# EAGLE design G8CntlA (109,5x19) (EAGLE 9.1.1)
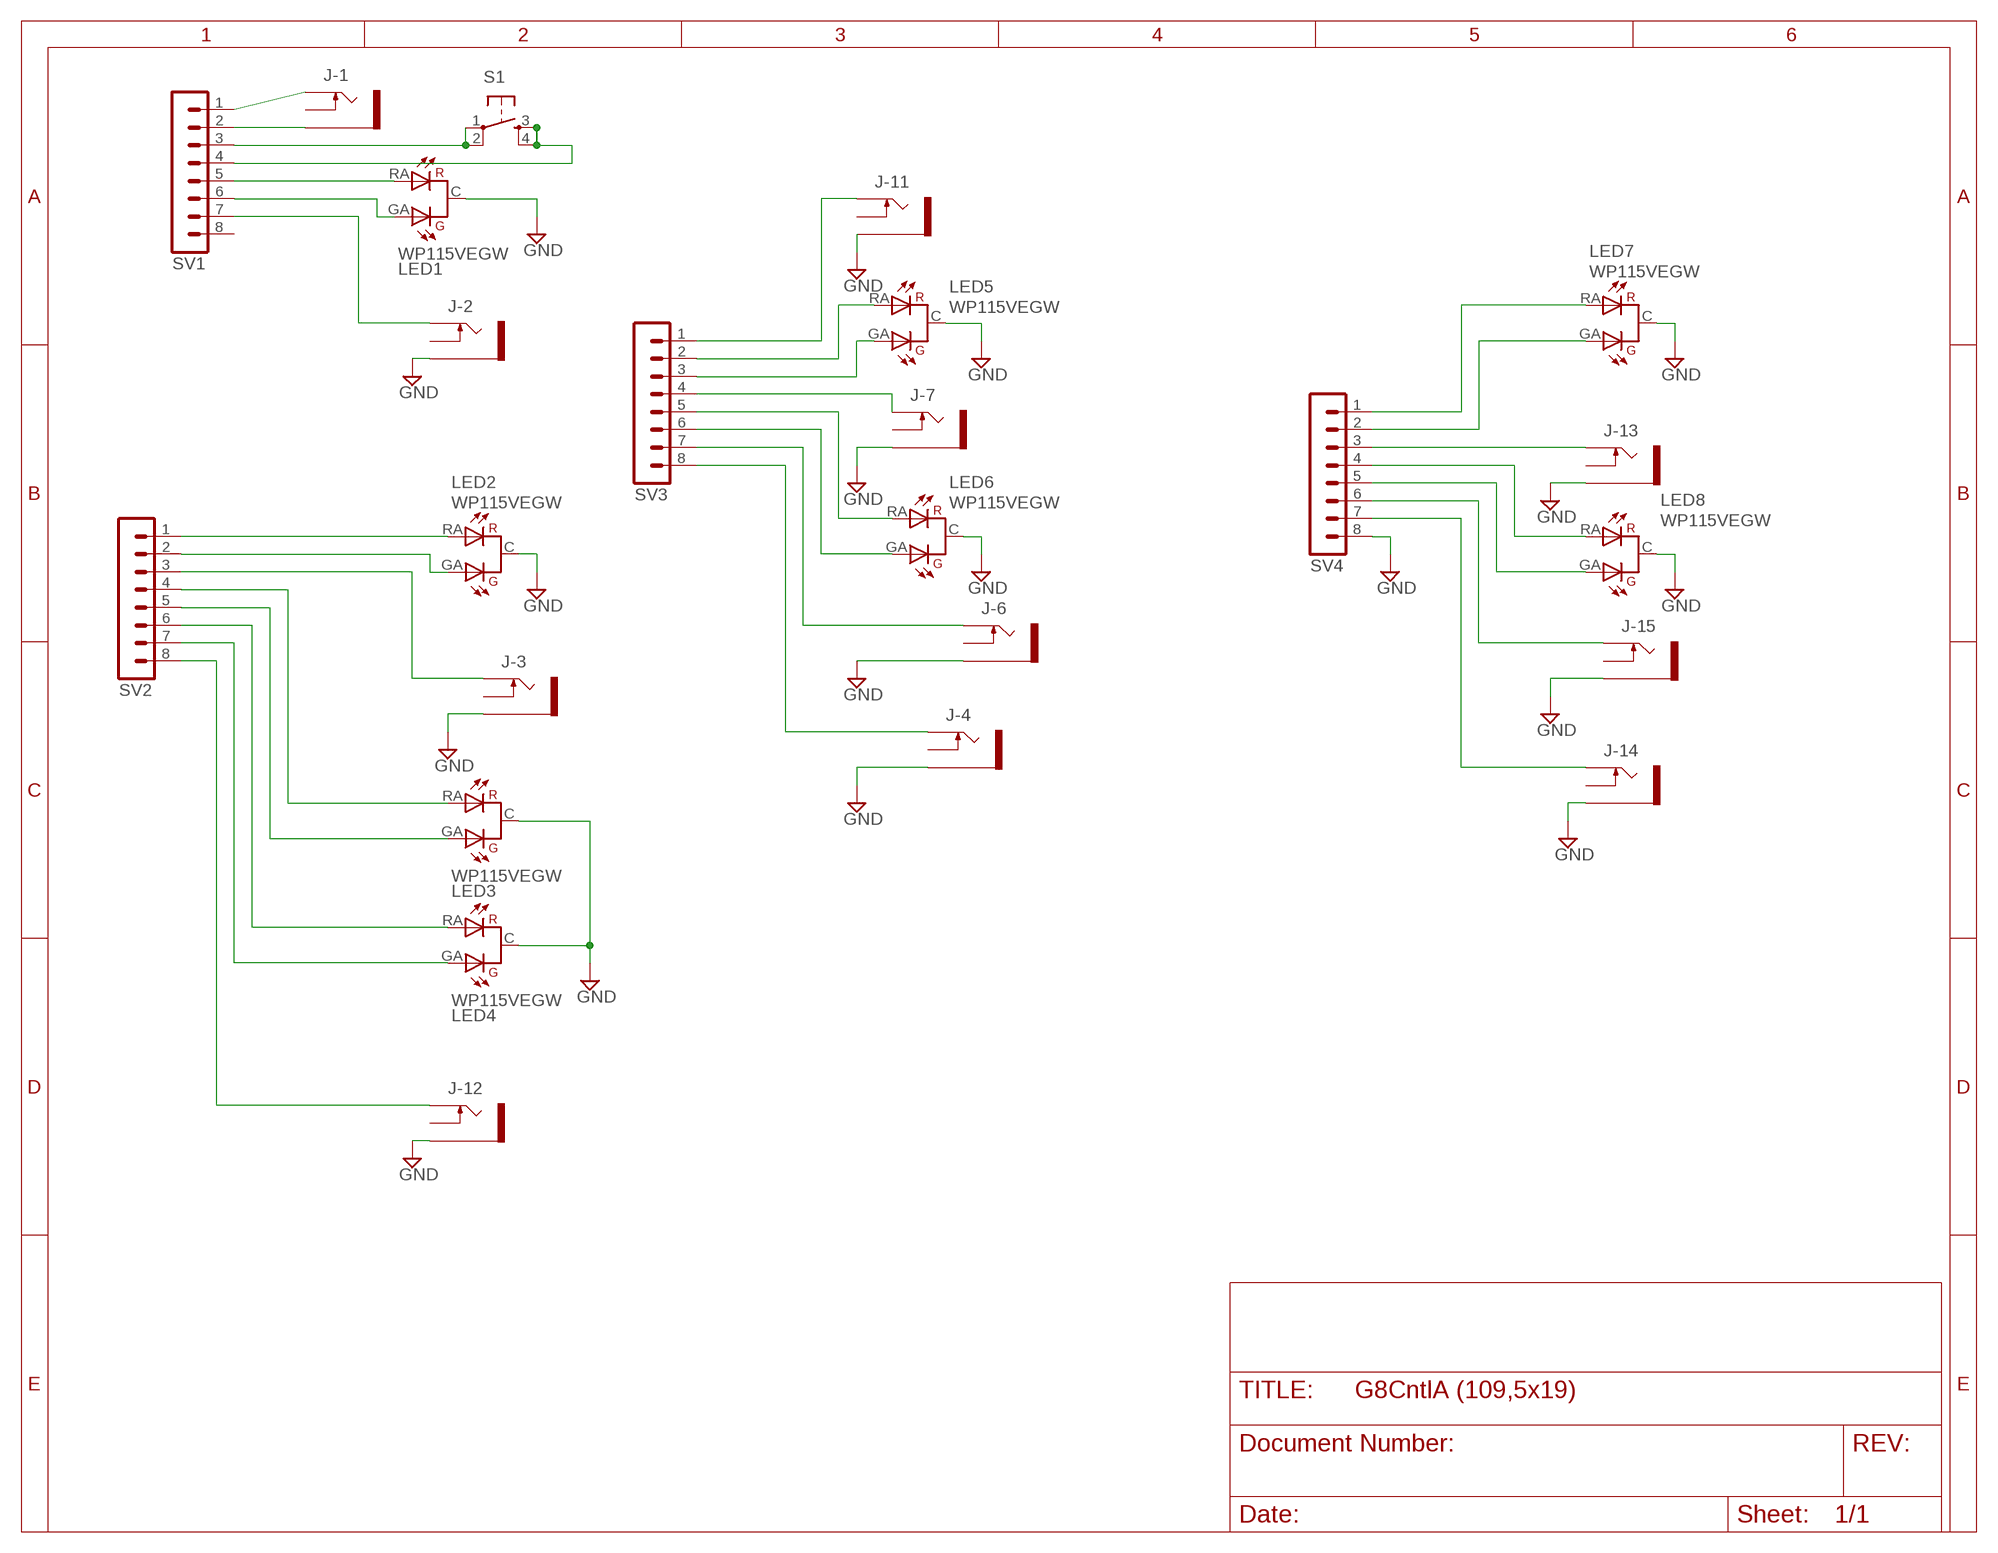
[diagram p0: schematic, sheet 1]

## Parts
J-1  THONKICONNNEW  [WQP-PJ301M-12_JACK]
J-2  THONKICONNNEW  [WQP-PJ301M-12_JACK]
J-3  THONKICONNNEW  [WQP-PJ301M-12_JACK]
J-4  THONKICONNNEW  [WQP-PJ301M-12_JACK]
J-6  THONKICONNNEW  [WQP-PJ301M-12_JACK]
J-7  THONKICONNNEW  [WQP-PJ301M-12_JACK]
J-11  THONKICONNNEW  [WQP-PJ301M-12_JACK]
J-12  THONKICONNNEW  [WQP-PJ301M-12_JACK]
J-13  THONKICONNNEW  [WQP-PJ301M-12_JACK]
J-14  THONKICONNNEW  [WQP-PJ301M-12_JACK]
J-15  THONKICONNNEW  [WQP-PJ301M-12_JACK]
LED1  WP115VEGW  [WP115VEGW]
LED2  WP115VEGW  [WP115VEGW]
LED3  WP115VEGW  [WP115VEGW]
LED4  WP115VEGW  [WP115VEGW]
LED5  WP115VEGW  [WP115VEGW]
LED6  WP115VEGW  [WP115VEGW]
LED7  WP115VEGW  [WP115VEGW]
LED8  WP115VEGW  [WP115VEGW]
S1  SPARKFUN_TAC_SWITCHPTH  [SPARKFUN_TACTILE-PTH]
SV1  MA08-1-O  [MA08-OCT]
SV2  MA08-1-O  [MA08-OCT]
SV3  MA08-1-O  [MA08-OCT]
SV4  MA08-1-O  [MA08-OCT]

## Nets
GND: J-2.P$3_SLEEVE(SLEEVE) J-3.P$3_SLEEVE(SLEEVE) J-4.P$3_SLEEVE(SLEEVE) J-6.P$3_SLEEVE(SLEEVE) J-7.P$3_SLEEVE(SLEEVE) J-11.P$3_SLEEVE(SLEEVE) J-12.P$3_SLEEVE(SLEEVE) J-13.P$3_SLEEVE(SLEEVE) J-14.P$3_SLEEVE(SLEEVE) J-15.P$3_SLEEVE(SLEEVE) LED1.C LED2.C LED3.C LED4.C LED5.C LED6.C LED7.C LED8.C SV4.8
N$1: S1.1 S1.2 SV1.3
N$2: S1.3 S1.4 SV1.4
N$3: LED2.RA(GA) SV2.1
N$4: J-1.P$1_TIP(TIP) SV1.1
N$5: J-1.P$3_SLEEVE(SLEEVE) SV1.2
N$6: J-2.P$1_TIP(TIP) SV1.7
N$7: LED1.RA(GA) SV1.5
N$8: LED1.GA(RA) SV1.6
N$9: LED2.GA(RA) SV2.2
N$10: J-3.P$1_TIP(TIP) SV2.3
N$11: LED3.RA(GA) SV2.4
N$12: LED3.GA(RA) SV2.5
N$13: J-12.P$1_TIP(TIP) SV2.8
N$14: LED4.RA(GA) SV2.6
N$15: LED4.GA(RA) SV2.7
N$16: J-11.P$1_TIP(TIP) SV3.1
N$17: LED5.RA(GA) SV3.2
N$18: LED5.GA(RA) SV3.3
N$19: J-7.P$1_TIP(TIP) SV3.4
N$20: LED6.RA(GA) SV3.5
N$21: LED6.GA(RA) SV3.6
N$22: J-6.P$1_TIP(TIP) SV3.7
N$23: J-4.P$1_TIP(TIP) SV3.8
N$24: J-15.P$1_TIP(TIP) SV4.6
N$25: J-13.P$1_TIP(TIP) SV4.3
N$26: J-14.P$1_TIP(TIP) SV4.7
N$27: LED7.RA(GA) SV4.1
N$28: LED7.GA(RA) SV4.2
N$29: LED8.RA(GA) SV4.4
N$30: LED8.GA(RA) SV4.5
Unconnected: J-1.P$2_SWITCH(SWITCH) J-2.P$2_SWITCH(SWITCH) J-3.P$2_SWITCH(SWITCH) J-4.P$2_SWITCH(SWITCH) J-6.P$2_SWITCH(SWITCH) J-7.P$2_SWITCH(SWITCH) J-11.P$2_SWITCH(SWITCH) J-12.P$2_SWITCH(SWITCH) J-13.P$2_SWITCH(SWITCH) J-14.P$2_SWITCH(SWITCH) J-15.P$2_SWITCH(SWITCH) SV1.8

## Library data of the parts
J-1-J-4 J-6 J-7 J-11-J-15 = !MusicThingModular:THONKICONN: 3.5mm socket for Eurorack modular synths
LED1-LED8 = tr-led:WP115VEGW
S1 = !tactile-pth:SPARKFUN_TAC_SWITCH: Momentary Switch Button commonly used for reset or general input. Spark Fun Electronics SKU : COM-00097
SV1-SV4 = tr-con:MA08-1: PIN HEADER

## Board
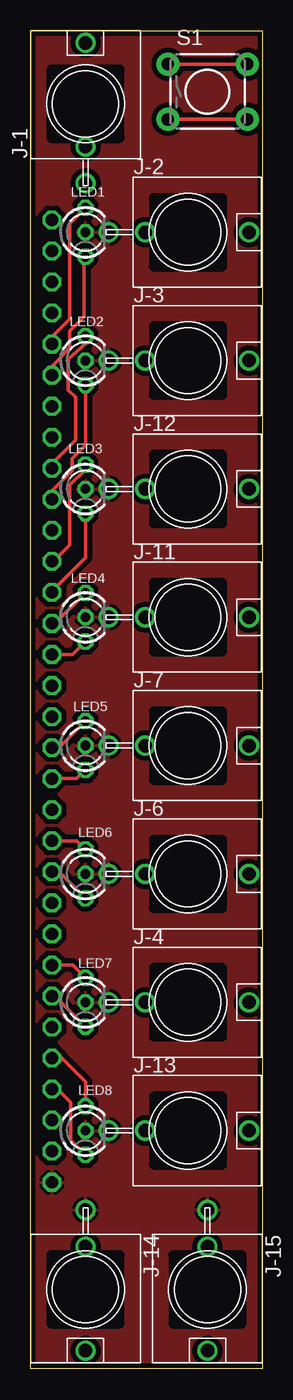
[diagram p1: board, top side]
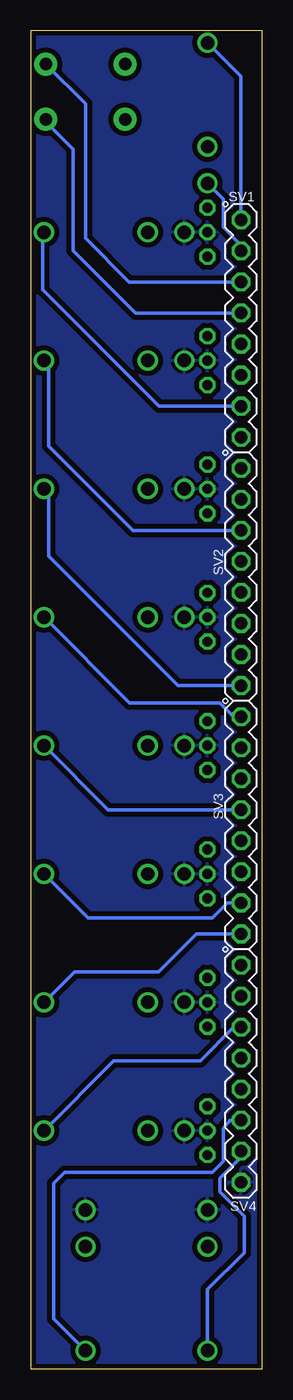
[diagram p2: board, bottom side, seen from below]

Size 19 x 109.5 mm. Coordinates in mm from the lower left corner, seen from the top.
Outline: 19,0 0,0 0,109.5 19,109.5 19,0
Copper layers (1*16): Top 0.035mm / dielectric 1.5mm / Bottom 0.035mm
Design rules "default *": minimum track width 8mil, minimum drill 24mil, track to track 8mil, track to pad 8mil, pad to pad 8mil, via to via 8mil, smd to smd 8mil, copper to edge 15mil, drill to drill 8mil, minimum pad ring 10mil, minimum via ring 8mil, stop-mask expansion 4mil, vias tented up to drill 0mil, thermal gap 10mil

### Footprints (pad centres in the part's own frame; a part is rotated, then mirrored left to right if it is on the bottom)
WQP-PJ301M-12_JACK = drill 1.1: P$1_TIP 0,5; P$2_SWITCH 0,-3.5; P$3_SLEEVE 0,-6.5
WP115VEGW = drill 0.8 octagon: C 0,0; GA 0,-2; RA 0,2
SPARKFUN_TACTILE-PTH = drill 1.016 pad 1.88: 1 -3.251,2.261; 2 3.251,2.261; 3 -3.251,-2.261; 4 3.251,-2.261
MA08-OCT = drill 1.016 octagon: 1 -8.89,0; 2 -6.35,0; 3 -3.81,0; 4 -1.27,0; 5 1.27,0; 6 3.81,0; 7 6.35,0; 8 8.89,0

### Placement (x,y rotation side)
J-1  4.5,103.5 0 top
J-2  12.9,93 270 top
J-3  12.9,82.5 270 top
J-4  12.9,30 270 top
J-6  12.9,40.5 270 top
J-7  12.9,51 270 top
J-11  12.9,61.5 270 top
J-12  12.9,72 270 top
J-13  12.9,19.5 270 top
J-14  4.5,6.5 180 top
J-15  14.5,6.5 180 top
LED1  4.5,93 0 top
LED2  4.5,82.5 0 top
LED3  4.5,72 0 top
LED4  4.5,61.5 0 top
LED5  4.5,51 0 top
LED6  4.5,40.5 0 top
LED7  4.5,30 0 top
LED8  4.5,19.5 0 top
S1  14.5,104.5 0 top
SV1  1.76,85.12 270 bottom
SV2  1.76,64.8 270 bottom
SV3  1.76,44.48 270 bottom
SV4  1.76,24.16 270 bottom

### Tracks (layer width: path | path; a pad name or v marks a point on that pad's centre or on a via)
GND
  pour Top (isolate 0.406): 28,114.5 -8,114.5 -5,-3 29,-4
  pour Bottom (isolate 0.406): 32,113.5 -6,114.5 -4,-5 32,-4
N$1
  Top 0.305: S1.1 S1.2
  Bottom 0.305: SV1.3 10.93,88.93 14.5,92.5 14.5,101 | 14.5,101 14.5,101.3 | 14.5,101 14.5,103.51 S1.2
N$2
  Top 0.305: S1.3 S1.4
  Bottom 0.305: SV1.4 10.39,86.39 15.5,91.5 15.5,99.8 17.75,102.05 S1.4
N$3
  Top 0.305: SV2.1 1.76,74.06 3.7,76 3.7,79.5 3.1,80.1 3.1,82.6 4.5,83.9 LED2.RA
N$4
  Bottom 0.305: SV1.1 1.76,105.76 J-1.P$1_TIP
N$5
  Bottom 0.305: SV1.2 1.76,91.96 3.2,93.4 3.2,95.7 J-1.P$3_SLEEVE
N$6
  Bottom 0.305: SV1.7 8.47,78.77 18,88.3 18,92.9 J-2.P$1_TIP
N$7
  Top 0.305: SV1.5 1.76,84.46 3.2,85.9 3.2,93.7 LED1.RA
N$8
  Top 0.305: SV1.6 1.76,82.06 3.2,83.5 3.2,84.9 4.4,86.1 4.4,90.9 LED1.GA
N$9
  Top 0.305: SV2.2 1.76,71.86 3.4,73.5 3.4,74.5 4.5,75.6 LED2.GA
N$10
  Bottom 0.305: SV2.3 10.61,68.61 17.5,75.5 17.5,82.1 J-3.P$1_TIP
N$11
  Top 0.305: SV2.4 1.87,66.07 3.2,67.4 3.2,72.3 4.5,73.6 LED3.RA
N$12
  Top 0.305: SV2.5 1.76,63.66 4.5,66.4 LED3.GA
N$13
  Bottom 0.305: SV2.8 6.91,55.91 17.5,66.5 17.5,71.6 J-12.P$1_TIP
N$14
  Top 0.305: SV2.6 1.99,60.99 LED4.RA
N$15
  Top 0.305: SV2.7 3.45,58.45 LED4.GA
N$16
  Bottom 0.305: SV3.1 2.37,53.37 3.5,54.5 10.9,54.5 J-11.P$1_TIP
N$17
  Top 0.305: SV3.2 2.33,50.83 LED5.RA
N$18
  Top 0.305: SV3.3 3.79,48.29 LED5.GA
N$19
  Bottom 0.305: SV3.4 12.65,45.75 J-7.P$1_TIP
N$20
  Top 0.305: SV3.5 3.79,43.21 LED6.RA
N$21
  Top 0.305: SV3.6 2.33,40.67 LED6.GA
N$22
  Bottom 0.305: SV3.7 2.87,38.13 4.1,36.9 14.3,36.9 J-6.P$1_TIP
N$23
  Bottom 0.305: SV3.8 5.41,35.59 8.5,32.5 15.4,32.5 J-4.P$1_TIP
N$24
  Bottom 0.305: SV4.6 2.65,20.35 3.2,19.7 3.2,17 4.1,16.1 16.2,16.1 17.1,15.2 17.1,4.1 J-15.P$1_TIP
N$25
  Bottom 0.305: SV4.3 2.33,27.97 5.1,25.2 12.2,25.2 J-13.P$1_TIP
N$26
  Bottom 0.305: J-14.P$1_TIP 4.5,6.5 1.5,9.5 1.5,12.5 3.5,14.5 3.5,15.6 1.9,17.2 1.9,17.67 SV4.7
N$27
  Top 0.305: SV4.1 3.45,33.05 LED7.RA
N$28
  Top 0.305: SV4.2 1.99,30.51 LED7.GA
N$29
  Top 0.305: SV4.4 2.57,25.43 4.5,23.5 LED8.RA
N$30
  Top 0.305: SV4.5 2.21,22.89 3.3,21.8 3.3,18.7 LED8.GA

### Text on the board
tDocu: G8 | Control | A | T100338 | (C) MMXIII | CIRCUIT ABBEY